# Altium project Liquid_Router.PrjPcb
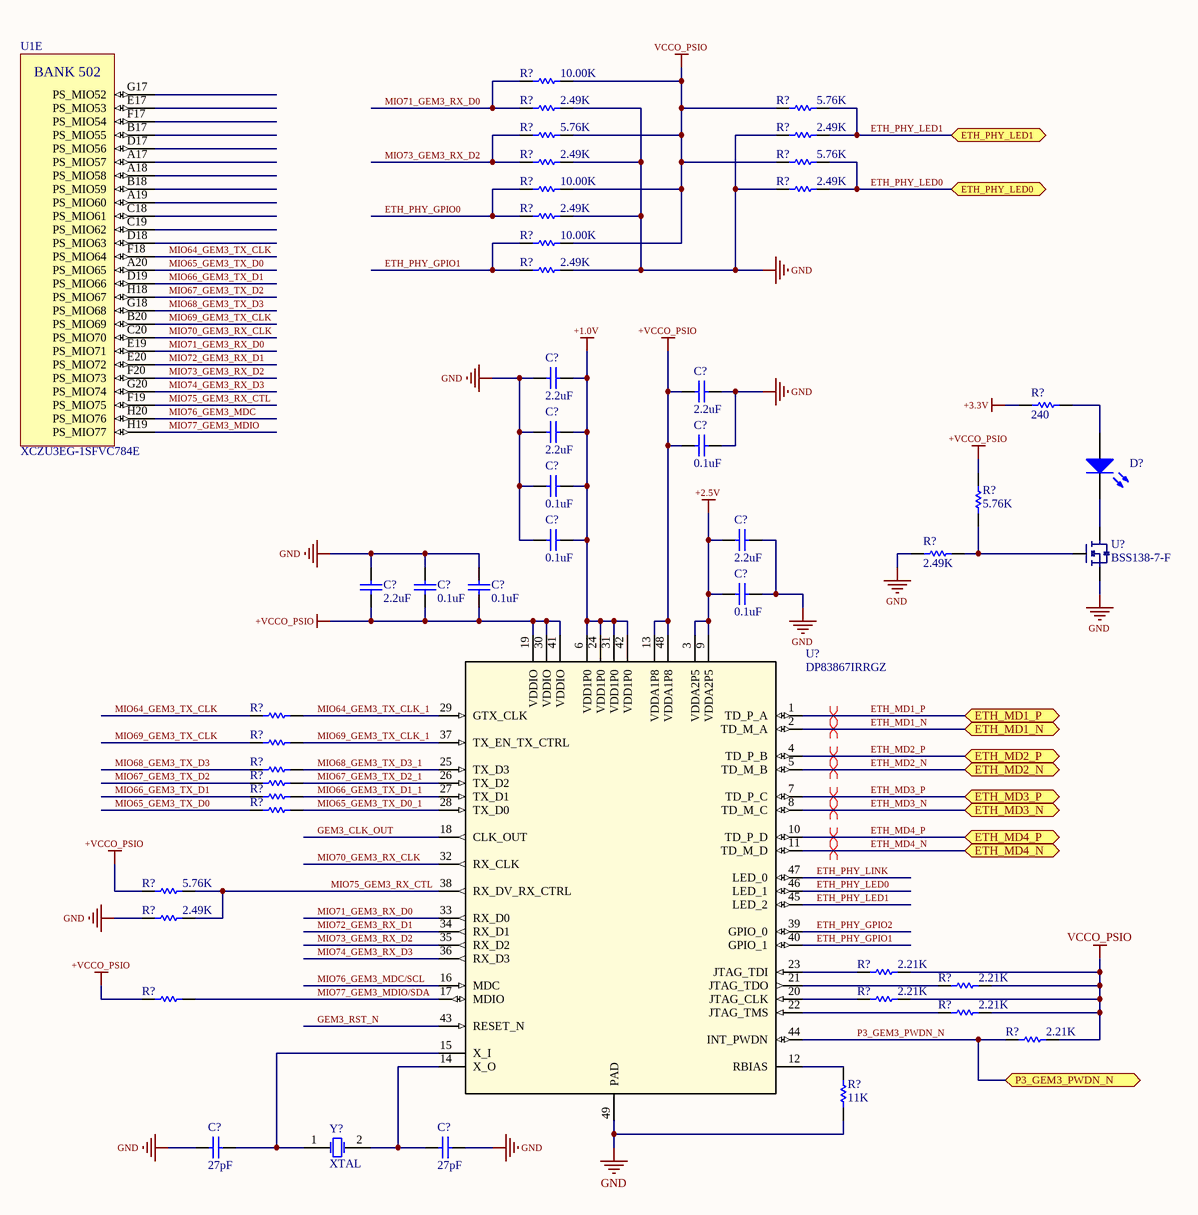
[diagram p0: ETH-PHY.SchDoc]
1 sheet, 48 parts. Net scope: flat (ports and power ports of the same name join across sheets).
Board file: PCB.PcbDoc

## Sheet ETH-PHY.SchDoc
size B

### Parts
(Parts that share a designator on the sheet are numbered #1, #2 ... from top to bottom, then left to right.)
C?#1  value 2.2uF  [RAD-0.3]  (hidden comment: Cap)
C?#2  value 2.2uF  [RAD-0.3]  (hidden comment: Cap)
C?#3  value 2.2uF  [RAD-0.3]  (hidden comment: Cap)
C?#4  value 0.1uF  [RAD-0.3]  (hidden comment: Cap)
C?#5  value 0.1uF  [RAD-0.3]  (hidden comment: Cap)
C?#6  value 0.1uF  [RAD-0.3]  (hidden comment: Cap)
C?#7  value 2.2uF  [RAD-0.3]  (hidden comment: Cap)
C?#8  value 0.1uF  [RAD-0.3]  (hidden comment: Cap)
C?#9  value 2.2uF  [RAD-0.3]  (hidden comment: Cap)
C?#10  value 0.1uF  [RAD-0.3]  (hidden comment: Cap)
C?#11  value 0.1uF  [RAD-0.3]  (hidden comment: Cap)
C?#12  value 27pF  [RAD-0.3]  (hidden comment: Cap)
C?#13  value 27pF  [RAD-0.3]  (hidden comment: Cap)
D?  LED2  [3.2X1.6X1.1]  (value not drawn)
R?#1  value 10.00K  [AXIAL-0.3]  (hidden comment: Res1)
R?#2  value 2.49K  [AXIAL-0.3]  (hidden comment: Res1)
R?#3  value 5.76K  [AXIAL-0.3]  (hidden comment: Res1)
R?#4  value 5.76K  [AXIAL-0.3]  (hidden comment: Res1)
R?#5  value 2.49K  [AXIAL-0.3]  (hidden comment: Res1)
R?#6  value 2.49K  [AXIAL-0.3]  (hidden comment: Res1)
R?#7  value 5.76K  [AXIAL-0.3]  (hidden comment: Res1)
R?#8  value 10.00K  [AXIAL-0.3]  (hidden comment: Res1)
R?#9  value 2.49K  [AXIAL-0.3]  (hidden comment: Res1)
R?#10  value 2.49K  [AXIAL-0.3]  (hidden comment: Res1)
R?#11  value 10.00K  [AXIAL-0.3]  (hidden comment: Res1)
R?#12  value 2.49K  [AXIAL-0.3]  (hidden comment: Res1)
R?#13  value 240  [AXIAL-0.3]  (hidden comment: Res1)
R?#14  value 5.76K  [AXIAL-0.3]  (hidden comment: Res1)
R?#15  value 2.49K  [AXIAL-0.3]  (hidden comment: Res1)
R?#16  Res1  [AXIAL-0.3]  (value not drawn)
R?#17  Res1  [AXIAL-0.3]  (value not drawn)
R?#18  Res1  [AXIAL-0.3]  (value not drawn)
R?#19  Res1  [AXIAL-0.3]  (value not drawn)
R?#20  Res1  [AXIAL-0.3]  (value not drawn)
R?#21  Res1  [AXIAL-0.3]  (value not drawn)
R?#22  value 5.76K  [AXIAL-0.3]  (hidden comment: Res1)
R?#23  value 2.49K  [AXIAL-0.3]  (hidden comment: Res1)
R?#24  value 2.21K  [AXIAL-0.3]  (hidden comment: Res1)
R?#25  value 2.21K  [AXIAL-0.3]  (hidden comment: Res1)
R?#26  Res1  [AXIAL-0.3]  (value not drawn)
R?#27  value 2.21K  [AXIAL-0.3]  (hidden comment: Res1)
R?#28  value 2.21K  [AXIAL-0.3]  (hidden comment: Res1)
R?#29  value 2.21K  [AXIAL-0.3]  (hidden comment: Res1)
R?#30  value 11K  [AXIAL-0.3]  (hidden comment: Res1)
U1  XCZU3EG-1SFVC784E  (part E of 5)
U?#1  BSS138-7-F
U?#2  DP83867IRRGZ
Y?  XTAL  [R38]

### Ports
ETH_MD1_N, ETH_MD1_P, ETH_MD2_N, ETH_MD2_P, ETH_MD3_N, ETH_MD3_P, ETH_MD4_N, ETH_MD4_P, ETH_PHY_LED0, ETH_PHY_LED1, P3_GEM3_PWDN_N

### Nets
+1.0V: C?#1.2 C?#3.2 C?#5.2 C?#6.2 U?#2.6(VDD1P0) U?#2.24(VDD1P0) U?#2.31(VDD1P0) U?#2.42(VDD1P0)
+2.5V: C?#7.1 C?#8.1 U?#2.3(VDDA2P5) U?#2.9(VDDA2P5)
+3.3V: R?#13.1
+VCCO_PSIO: C?#2.1 C?#4.1 C?#9.1 C?#10.1 C?#11.1 R?#14.2 R?#22.1 R?#26.1 U?#2.13(VDDA1P8) U?#2.19(VDDIO) U?#2.30(VDDIO) U?#2.41(VDDIO) U?#2.48(VDDA1P8)
GND: C?#1.1 C?#2.2 C?#3.1 C?#4.2 C?#5.1 C?#6.1 C?#7.2 C?#8.2 C?#9.2 C?#10.2 C?#11.2 C?#12.1 C?#13.2 R?#2.2 R?#5.1 R?#6.2 R?#9.1 R?#10.2 R?#12.2 R?#15.1 R?#23.1 R?#30.1 U?#1.1 U?#2.49(PAD)
VCCO_PSIO: R?#1.2 R?#3.1 R?#4.2 R?#7.1 R?#8.2 R?#11.2 R?#24.2 R?#25.2 R?#27.2 R?#28.2 R?#29.2
ETH_MD1_N: U?#2.2(TD_M_A) ; port ETH_MD1_N
ETH_MD1_P: U?#2.1(TD_P_A) ; port ETH_MD1_P
ETH_MD2_N: U?#2.5(TD_M_B) ; port ETH_MD2_N
ETH_MD2_P: U?#2.4(TD_P_B) ; port ETH_MD2_P
ETH_MD3_N: U?#2.8(TD_M_C) ; port ETH_MD3_N
ETH_MD3_P: U?#2.7(TD_P_C) ; port ETH_MD3_P
ETH_MD4_N: U?#2.11(TD_M_D) ; port ETH_MD4_N
ETH_MD4_P: U?#2.10(TD_P_D) ; port ETH_MD4_P
ETH_PHY_GPIO0: R?#8.1 R?#10.1
ETH_PHY_GPIO1: R?#11.1 R?#12.1 U?#2.40(GPIO_1)
ETH_PHY_GPIO2: U?#2.39(GPIO_0)
ETH_PHY_LED0: R?#7.2 R?#9.2 U?#2.46(LED_1) ; port ETH_PHY_LED0
ETH_PHY_LED1: R?#3.2 R?#5.2 U?#2.45(LED_2) ; port ETH_PHY_LED1
ETH_PHY_LINK: U?#2.47(LED_0)
GEM3_CLK_OUT: U?#2.18(CLK_OUT)
GEM3_RST_N: U?#2.43(RESET_N)
MIO64_GEM3_TX_CLK: R?#16.1 U1.F18(PS_MIO64)
MIO64_GEM3_TX_CLK_1: R?#16.2 U?#2.29(GTX_CLK)
MIO65_GEM3_TX_D0: R?#21.1 U1.A20(PS_MIO65)
MIO65_GEM3_TX_D0_1: R?#21.2 U?#2.28(TX_D0)
MIO66_GEM3_TX_D1: R?#20.1 U1.D19(PS_MIO66)
MIO66_GEM3_TX_D1_1: R?#20.2 U?#2.27(TX_D1)
MIO67_GEM3_TX_D2: R?#19.1 U1.H18(PS_MIO67)
MIO67_GEM3_TX_D2_1: R?#19.2 U?#2.26(TX_D2)
MIO68_GEM3_TX_D3: R?#18.1 U1.G18(PS_MIO68)
MIO68_GEM3_TX_D3_1: R?#18.2 U?#2.25(TX_D3)
MIO69_GEM3_TX_CLK: R?#17.1 U1.B20(PS_MIO69)
MIO69_GEM3_TX_CLK_1: R?#17.2 U?#2.37(TX_EN_TX_CTRL)
MIO70_GEM3_RX_CLK: U1.C20(PS_MIO70) U?#2.32(RX_CLK)
MIO71_GEM3_RX_D0: R?#1.1 R?#2.1 U1.E19(PS_MIO71) U?#2.33(RX_D0)
MIO72_GEM3_RX_D1: U1.E20(PS_MIO72) U?#2.34(RX_D1)
MIO73_GEM3_RX_D2: R?#4.1 R?#6.1 U1.F20(PS_MIO73) U?#2.35(RX_D2)
MIO74_GEM3_RX_D3: U1.G20(PS_MIO74) U?#2.36(RX_D3)
MIO75_GEM3_RX_CTL: R?#22.2 R?#23.2 U1.F19(PS_MIO75) U?#2.38(RX_DV_RX_CTRL)
MIO76_GEM3_MDC: U1.H20(PS_MIO76)
MIO76_GEM3_MDC/SCL: U?#2.16(MDC)
MIO77_GEM3_MDIO: U1.H19(PS_MIO77)
MIO77_GEM3_MDIO/SDA: R?#26.2 U?#2.17(MDIO)
P3_GEM3_PWDN_N: R?#29.1 U?#2.44(INT_PWDN) ; port P3_GEM3_PWDN_N
NetC?#12_2: C?#12.2 U?#2.15(X_I) Y?.1(OSC1)
NetC?#13_1: C?#13.1 U?#2.14(X_O) Y?.2(OSC2)
NetD?_1: D?.1(A) R?#13.2
NetD?_2: D?.2(K) U?#1.1
NetR?#14_1: R?#14.1 R?#15.2 U?#1.1
NetR?#24_1: R?#24.1 U?#2.23(JTAG_TDI)
NetR?#25_1: R?#25.1 U?#2.21(JTAG_TDO)
NetR?#27_1: R?#27.1 U?#2.20(JTAG_CLK)
NetR?#28_1: R?#28.1 U?#2.22(JTAG_TMS)
NetR?#30_2: R?#30.2 U?#2.12(RBIAS)

Not connected (* = marked no-connect by the designer): U1 A17(PS_MIO57) A18(PS_MIO58) A19(PS_MIO60) B17(PS_MIO55) B18(PS_MIO59) C18(PS_MIO61) C19(PS_MIO62) D17(PS_MIO56) D18(PS_MIO63) E17(PS_MIO53) F17(PS_MIO54) G17(PS_MIO52)

### Layout directives
differential pair: ETH_MD1_N, ETH_MD1_P, ETH_MD2_N, ETH_MD2_P, ETH_MD3_N, ETH_MD3_P, ETH_MD4_N, ETH_MD4_P

### Notes on the sheet
- (in symbol XCZU3EG-1SFVC784E, part E) BANK 502

### Library data of the parts
C?#1-C?#13 = Cap: Capacitor; Published: 8-Jun-2000; LatestRevisionDate: 17-Jul-2002; LatestRevisionNote: Re-released for DXP Platform.; PackageReference: RAD-0.3; Publisher: Altium Limited; PackageDescription: Radial Cap, Thru-Hole; 2 Leads; 0.3 in Pin Spacing
D? = LED2: Typical RED, GREEN, YELLOW, AMBER GaAs LED; Published: 8-Jun-2000; LatestRevisionDate: 17-Jul-2002; LatestRevisionNote: Re-released for DXP Platform.; PackageVersion: Feb-2002; PackageReference: 3.2X1.6X1.1; Publisher: Altium Limited; PackageDescription: SM LED; 2 Flat Leads
R?#1-R?#15 R?#22-R?#25 R?#27-R?#30 = Res1: Resistor; Published: 8-Jun-2000; LatestRevisionDate: 17-Jul-2002; LatestRevisionNote: Re-released for DXP Platform.; PackageReference: AXIAL-0.3; Publisher: Altium Limited; PackageDescription: Axial Device, Thru-Hole; 2 Leads; 0.3 in Pin Spacing
R?#16-R?#21 R?#26 = Res1: Resistor; Value: 0; Published: 8-Jun-2000; LatestRevisionDate: 17-Jul-2002; LatestRevisionNote: Re-released for DXP Platform.; PackageReference: AXIAL-0.3; Publisher: Altium Limited; PackageDescription: Axial Device, Thru-Hole; 2 Leads; 0.3 in Pin Spacing
U?#2 = DP83867IRRGZ: Ethernet 10/100/1000 Base-TX PHY; Manufacturer: Texas Instruments; Manufacturer Part Number: DP83867IRRGZR; Function: Physical Layer Controller; Interface: Serial; Voltage-Supply: 1.1V, 2.5V; Current-Supply: 157mA; Detailed Description: Ethernet Physical Layer Controller 10/100/1000 Base-TX PHY Serial Interface 48-VQFN (7x7); Protocol: Ethernet; Standards: 10/100/1000 Base-TX PHY; Operating Temperature: -40 ~85 C; Package/Case: 48-VFQFN Exposed Pad; Supplier Device Package: 48-VQFN (7x7); Digi-Key part Number: DP83867IRRGZR-ND; Mount Type: SMT
Y? = XTAL: Crystal Oscillator; Published: 8-Jun-2000; LatestRevisionDate: 17-Jul-2002; LatestRevisionNote: Re-released for DXP Platform.; PackageReference: R38; Publisher: Altium Limited; PackageDescription: Crystal, Thru-Hole; 2 Leads; Body 3.1 x 8.2 mm (Dia.xH)